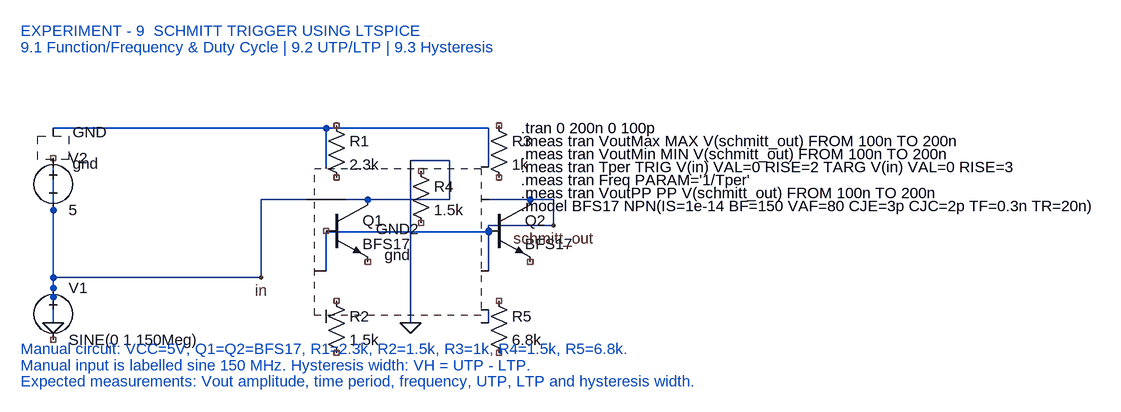
[diagram p0: schematic ECA0409_LTSpice_Schmitt_Trigger.asc]
ECA0409_LTSpice_Schmitt_Trigger.asc, the LTspice schematic file:
Version 4
SHEET 1 1200 800
FLAG 450 500 in
FLAG 900 420 schmitt_out
FLAG 130 570 0
FLAG 680 570 0
SYMBOL voltage 130 300 R0
SYMATTR InstName V2
SYMATTR Value 5
SYMBOL voltage 130 500 R0
SYMATTR InstName V1
SYMATTR Value SINE(0 1 150Meg)
SYMATTR SpiceLine AC 1
SYMBOL npn 550 380 R0
SYMATTR InstName Q1
SYMATTR Value BFS17
SYMBOL npn 800 380 R0
SYMATTR InstName Q2
SYMATTR Value BFS17
SYMBOL res 550 250 R0
SYMATTR InstName R1
SYMATTR Value 2.3k
SYMBOL res 550 520 R0
SYMATTR InstName R2
SYMATTR Value 1.5k
SYMBOL res 800 250 R0
SYMATTR InstName R3
SYMATTR Value 1k
SYMBOL res 680 320 R0
SYMATTR InstName R4
SYMATTR Value 1.5k
SYMBOL res 800 520 R0
SYMATTR InstName R5
SYMATTR Value 6.8k
SYMBOL gnd 130 570 R0
SYMATTR InstName GND
WIRE 130 270 800 270
WIRE 130 330 130 570
WIRE 130 530 130 570
WIRE 550 270 550 330
WIRE 550 430 550 490
WIRE 550 550 550 570
WIRE 800 270 800 330
WIRE 800 430 800 490
WIRE 800 550 800 570
WIRE 130 500 450 500
WIRE 450 500 450 380
WIRE 450 380 520 380
WIRE 580 380 740 380
WIRE 740 380 740 320
WIRE 740 320 680 320
WIRE 680 350 680 570
WIRE 800 380 900 380
WIRE 900 380 900 420
WIRE 900 420 800 420
WIRE 800 420 800 430
WIRE 550 430 800 430
SYMBOL gnd 680 570 R0
SYMATTR InstName GND2
TEXT 80 120 Left 2 EXPERIMENT - 9  SCHMITT TRIGGER USING LTSPICE
TEXT 80 145 Left 2 9.1 Function/Frequency & Duty Cycle | 9.2 UTP/LTP | 9.3 Hysteresis
TEXT 80 610 Left 2 Manual circuit: VCC=5V, Q1=Q2=BFS17, R1=2.3k, R2=1.5k, R3=1k, R4=1.5k, R5=6.8k.
TEXT 80 635 Left 2 Manual input is labelled sine 150 MHz. Hysteresis width: VH = UTP - LTP.
TEXT 80 660 Left 2 Expected measurements: Vout amplitude, time period, frequency, UTP, LTP and hysteresis width.
TEXT 850 270 Left 2 !.tran 0 200n 0 100p
TEXT 850 290 Left 2 !.meas tran VoutMax MAX V(schmitt_out) FROM 100n TO 200n
TEXT 850 310 Left 2 !.meas tran VoutMin MIN V(schmitt_out) FROM 100n TO 200n
TEXT 850 330 Left 2 !.meas tran Tper TRIG V(in) VAL=0 RISE=2 TARG V(in) VAL=0 RISE=3
TEXT 850 350 Left 2 !.meas tran Freq PARAM='1/Tper'
TEXT 850 370 Left 2 !.meas tran VoutPP PP V(schmitt_out) FROM 100n TO 200n
TEXT 850 390 Left 2 !.model BFS17 NPN(IS=1e-14 BF=150 VAF=80 CJE=3p CJC=2p TF=0.3n TR=20n)

The netlist it stands for:
* ECA0409_LTSpice_Schmitt_Trigger.asc
V2 NC_01 0 5
V1 0 NC_02 SINE(0 1 150Meg) AC 1
Q1 N004 NC_03 NC_04 0 BFS17
Q2 schmitt_out schmitt_out NC_05 0 BFS17
R1 NC_06 NC_07 2.3k
R2 NC_08 NC_09 1.5k
R3 NC_10 NC_11 1k
R4 NC_12 NC_13 1.5k
R5 NC_14 NC_15 6.8k
* GND: gnd (symbol gnd not available, pin order unknown); nets seen at it: 0, N001
* GND2: gnd (symbol gnd not available, pin order unknown); nets seen at it: 0, N001, N002, N003, N004, schmitt_out
.model NPN NPN
.model PNP PNP
.lib standard.bjt
* EXPERIMENT - 9  SCHMITT TRIGGER USING LTSPICE
* 9.1 Function/Frequency & Duty Cycle | 9.2 UTP/LTP | 9.3 Hysteresis
* Manual circuit: VCC=5V, Q1=Q2=BFS17, R1=2.3k, R2=1.5k, R3=1k, R4=1.5k, R5=6.8k.
* Manual input is labelled sine 150 MHz. Hysteresis width: VH = UTP - LTP.
* Expected measurements: Vout amplitude, time period, frequency, UTP, LTP and hysteresis width.
.tran 0 200n 0 100p
.meas tran VoutMax MAX V(schmitt_out) FROM 100n TO 200n
.meas tran VoutMin MIN V(schmitt_out) FROM 100n TO 200n
.meas tran Tper TRIG V(in) VAL=0 RISE=2 TARG V(in) VAL=0 RISE=3
.meas tran Freq PARAM='1/Tper'
.meas tran VoutPP PP V(schmitt_out) FROM 100n TO 200n
.model BFS17 NPN(IS=1e-14 BF=150 VAF=80 CJE=3p CJC=2p TF=0.3n TR=20n)
.backanno
.end